# Altium schematic sheet CH32L103F8P6-R0.SchDoc
size 304 x 254 mm
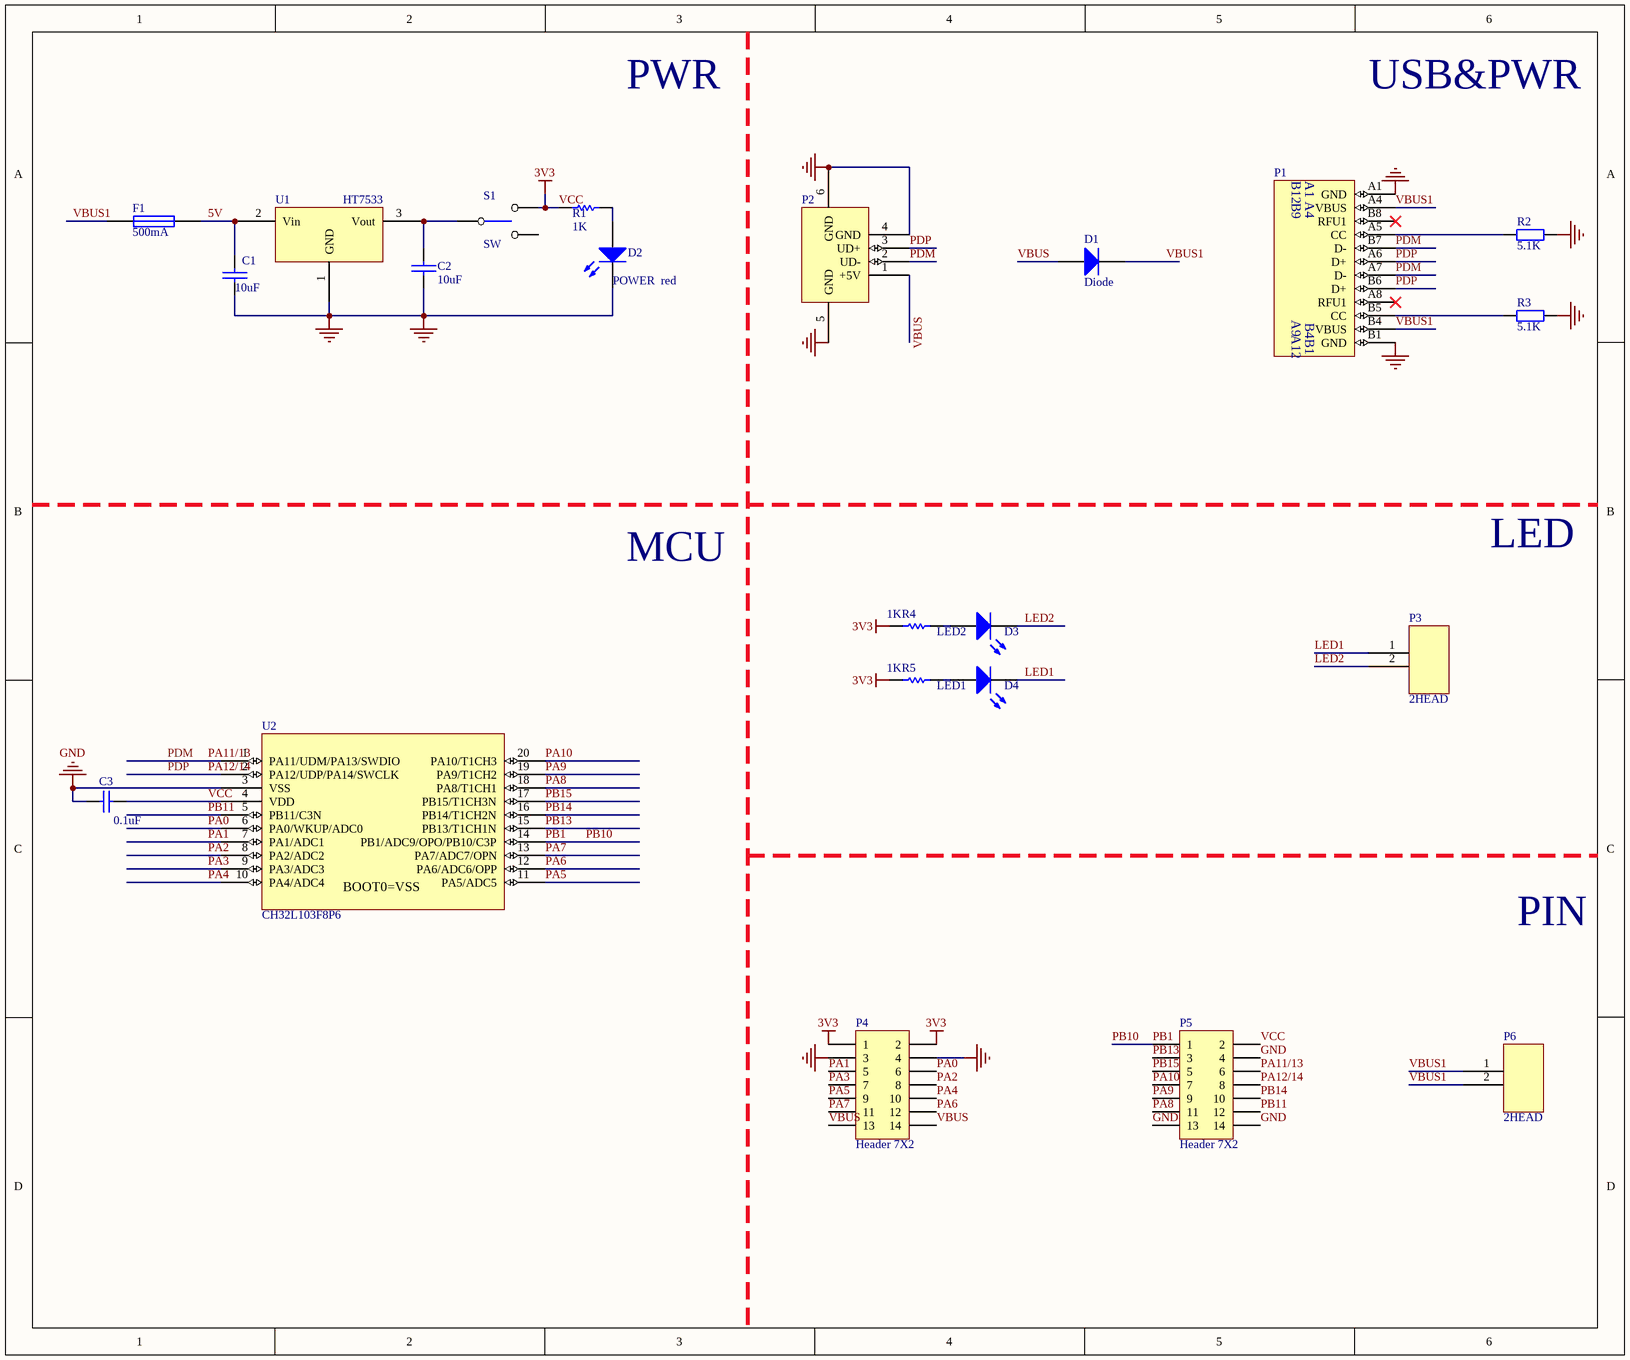
[diagram p0: CH32L103F8P6-R0.SchDoc]

## Parts
C1  10uF  [0603_C]
C2  10uF  [0603_C]
C3  0.1uF  [0603_C]
D1  Diode  [SOD-123]
D2  POWER  red  [0603+]
D3  LED2  [0603+]
D4  LED1  [0603+]
F1  500mA  [0603]
P1  TYPE-C  [TYPE-C-Receptacle-2.0]  (value not drawn)
P2  USB_A  [USBAF]  (value not drawn)
P3  2HEAD  [SIP2-2.54mm]
P4  Header 7X2  [IDC14-2.54mm]
P5  Header 7X2  [IDC14-2.54mm]
P6  2HEAD  [SIP2-2.54mm]
R1  1K  [0603]
R2  5.1K  [0603]
R3  5.1K  [0603]
R4  1K  [0603]
R5  1K  [0603]
S1  SW  [SW1]
U1  HT7533  [SOT-89]
U2  CH32L103F8P6  [TSSOP20]

## Nets
GND: C1.2 C2.2 C3.1 D2.2(K) P1.A1(GND) P1.B1(GND) P2.4(GND) P2.5(GND) P2.6(GND) P4.3 P4.4 P5.4 P5.13 P5.14 R2.2 R3.2 U1.1(GND) U2.3(VSS)
VCC: C3.2 P4.1 P4.2 P5.2 R1.2 R4.1 R5.1 S1.3 U2.4(VDD)  [also labelled 3V3]
5V: C1.1 F1.2 U1.2(Vin)
LED1: D4.2(K) P3.1
LED2: D3.2(K) P3.2
PA0: P4.6 U2.6(PA0/WKUP/ADC0)
PA1: P4.5 U2.7(PA1/ADC1)
PA2: P4.8 U2.8(PA2/ADC2)
PA3: P4.7 U2.9(PA3/ADC3)
PA4: P4.10 U2.10(PA4/ADC4)
PA5: P4.9 U2.11(PA5/ADC5)
PA6: P4.12 U2.12(PA6/ADC6/OPP)
PA7: P4.11 U2.13(PA7/ADC7/OPN)
PA8: P5.11 U2.18(PA8/T1CH1)
PA9: P5.9 U2.19(PA9/T1CH2)
PA10: P5.7 U2.20(PA10/T1CH3)
PA11/13: P1.A7(D-) P1.B7(D-) P2.2(UD-) P5.6 U2.1(PA11/UDM/PA13/SWDIO)  [also labelled PDM]
PA12/14: P1.A6(D+) P1.B6(D+) P2.3(UD+) P5.8 U2.2(PA12/UDP/PA14/SWCLK)  [also labelled PDP]
PB1: P5.1 U2.14(PB1/ADC9/OPO/PB10/C3P)  [also labelled PB10]
PB11: P5.12 U2.5(PB11/C3N)
PB13: P5.3 U2.15(PB13/T1CH1N)
PB14: P5.10 U2.16(PB14/T1CH2N)
PB15: P5.5 U2.17(PB15/T1CH3N)
VBUS: D1.1(A) P2.1(+5V) P4.13 P4.14
VBUS1: D1.2(K) F1.1 P1.A4(VBUS) P1.B4(VBUS) P6.1 P6.2
NetC2_1: C2.1 S1.1 U1.3(Vout)
NetD2_1: D2.1(A) R1.1
NetD3_1: D3.1(A) R4.2
NetD4_1: D4.1(A) R5.2
NetP1_A5: P1.A5(CC) R2.1
NetP1_B5: P1.B5(CC) R3.1

Not connected (* = marked no-connect by the designer): P1 A8(RFU1)* B8(RFU1)*; S1 2

## Notes on the sheet
- PWR
- USB&PWR
- MCU
- LED
- PIN
- (in symbol CH32L103F8P6) BOOT0=VSS
- (in symbol TYPE-C1) B12; B9; A9; A12

## Library data of the parts
C1 C2 = CAP: Capacitor
C3 = Cap: Capacitor; Value: 15pF; Published: 8-Jun-2000; LatestRevisionDate: 17-Jul-2002; LatestRevisionNote: Re-released for DXP Platform.; PackageReference: RAD-0.3; Publisher: Altium Limited
D1 = Diode: Default Diode; Published: 8-Jun-2000; LatestRevisionDate: 17-Jul-2002; LatestRevisionNote: Re-released for DXP Platform.; PackageVersion: Sep-1996; PackageReference: SMC; Publisher: Altium Limited; Code_JEDEC: DO-214-AB
D2-D4 = LED0: Typical INFRARED GaAs LED; Published: 8-Jun-2000; LatestRevisionDate: 08-Jul-2005; LatestRevisionNote: Mech Layer 1 removed.; PackageReference: LED-0; Publisher: Altium Limited
F1 = FUSE1: Fuse
P1 = TYPE-C1
P2 = USB: USB Port
P4 P5 = Header 7X2: Header, 7-Pin, Dual row; LatestRevisionDate: 17-Jul-2002; LatestRevisionNote: Re-released for DXP Platform.; Publisher: Altium Limited
R1 R4 R5 = Res Semi: Semiconductor Resistor
R2 R3 = Res2: Resistor
U1 = 1117-3.3V
U2 = CH32L103F8P6: RISC-V LMD-MCU, 96MHz, USB, CAN, OPA, lower power, for motor